# EAGLE design esp8266-DS18B20 (EAGLE 7.6.0)
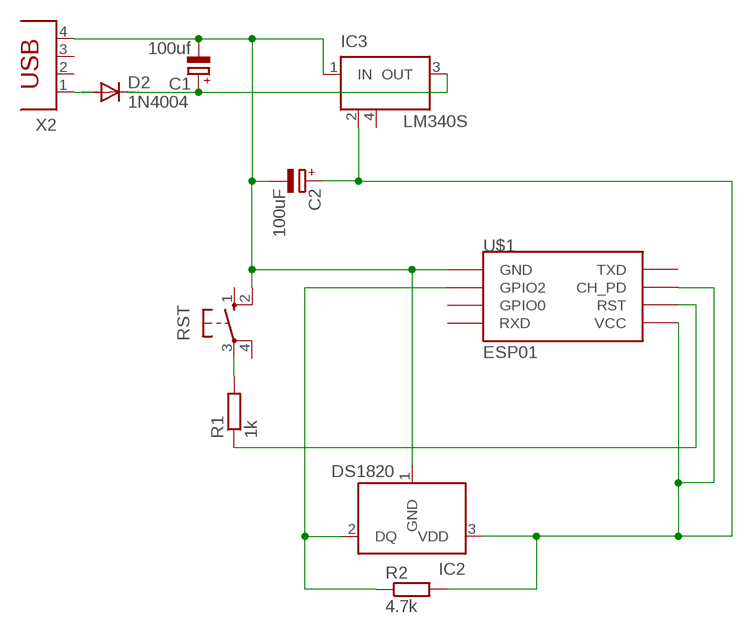
[diagram p0: schematic, sheet 1]

## Parts
C1  100uf  CPOL-EUE2.5-5  [E2,5-5]
C2  100uF  CPOL-EUE2.5-5  [E2,5-5]
D2  1N4004  [DO41-10]
IC2  DS1820  [TO-92]
IC3  LM340S  [SOT223]
R1  1k  R-EU_0207/12  [0207/12]
R2  4.7k  R-EU_0207/12  [0207/12]
RST  10-XX  [B3F-10XX]
U$1  ESP01  [ESP01]
X2  PN61729  [PN61729]

## Nets
3V3: C2.+ IC2.3(VDD) IC3.2(GND) R2.2 U$1.CH_PD U$1.VCC
5V: C1.+ D2.A D2.C IC3.3(OUT) X2.1
DQ: IC2.2(DQ) R2.1 U$1.GPIO2
GND: C1.- C2.- IC2.1(GND) IC3.1(IN) RST.2(S1) U$1.GND X2.4
GND(RST): R1.2 RST.3(P)
RST: R1.1 U$1.RST
Unconnected: RST.1(S) RST.4(P1) U$1.GPIO0 U$1.RX(RXD) U$1.TX(TXD) X2.2 X2.3

## Power pins joined to a net without a drawn wire
GND: IC3.4(GND)

## Library data of the parts
C1 C2 = rcl:CPOL-EU: POLARIZED CAPACITOR, European symbol
D2 = diode:1N4004: DIODE general purpose rectifier, 1 A
IC2 = DS1820:DS1820: DS1820 - 1-Wire Digital Thermometer
IC3 = linear:LM340S: 3-Terminal Positive Regulators Source: http://cache.national.com/ds/LM/LM340.pdf
R1 R2 = resistor:R-EU_: RESISTOR, European symbol
RST = switch-omron:10-XX: OMRON SWITCH; MPN: B3F-1000; OC_FARNELL: 176432; OC_NEWARK: 36M3542
U$1 = esp8266modules:ESP01: ESP8266 Wifi module 01
X2 = con-berg:PN61729: BERG USB connector; OC_FARNELL: unknown; OC_NEWARK: unknown

## Board
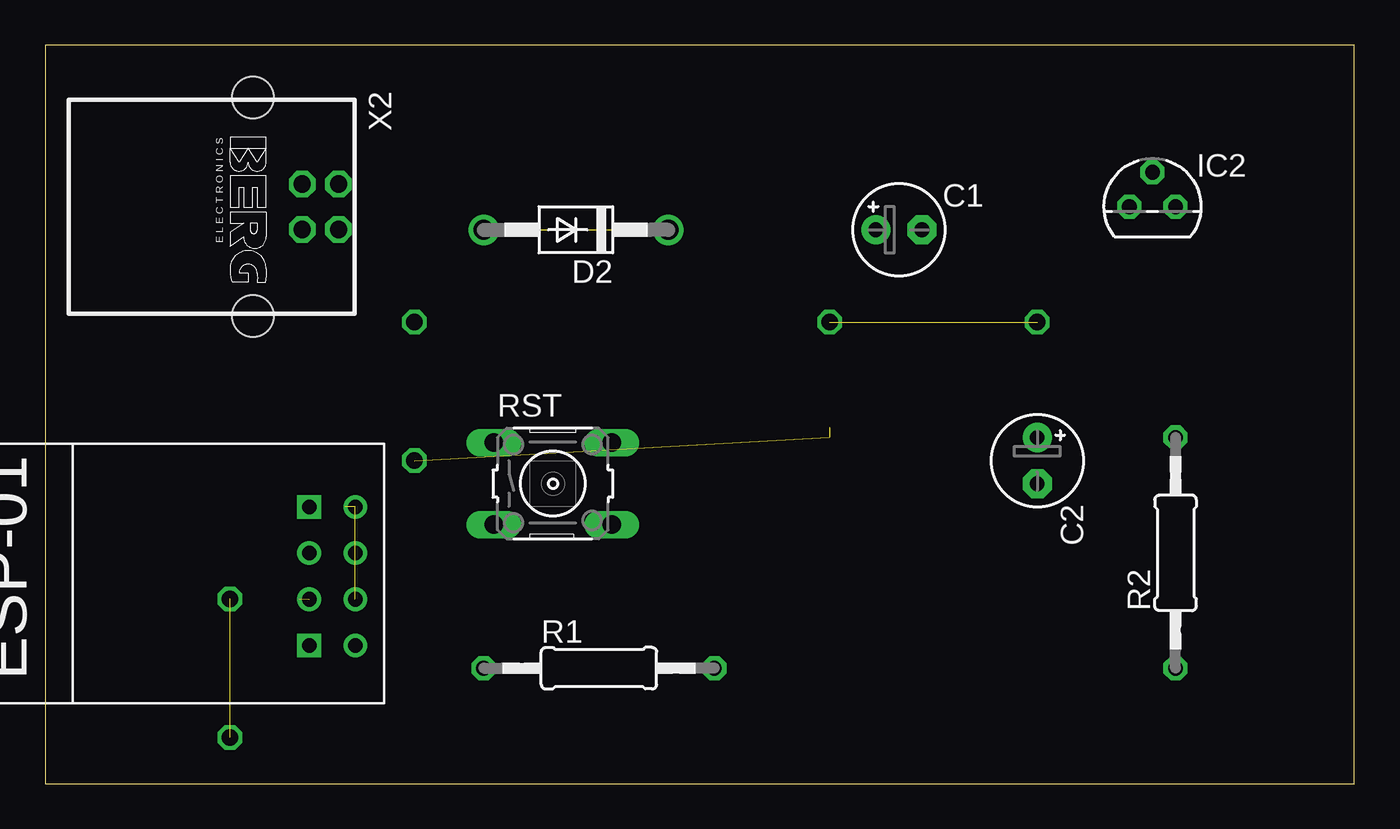
[diagram p1: board, top side]
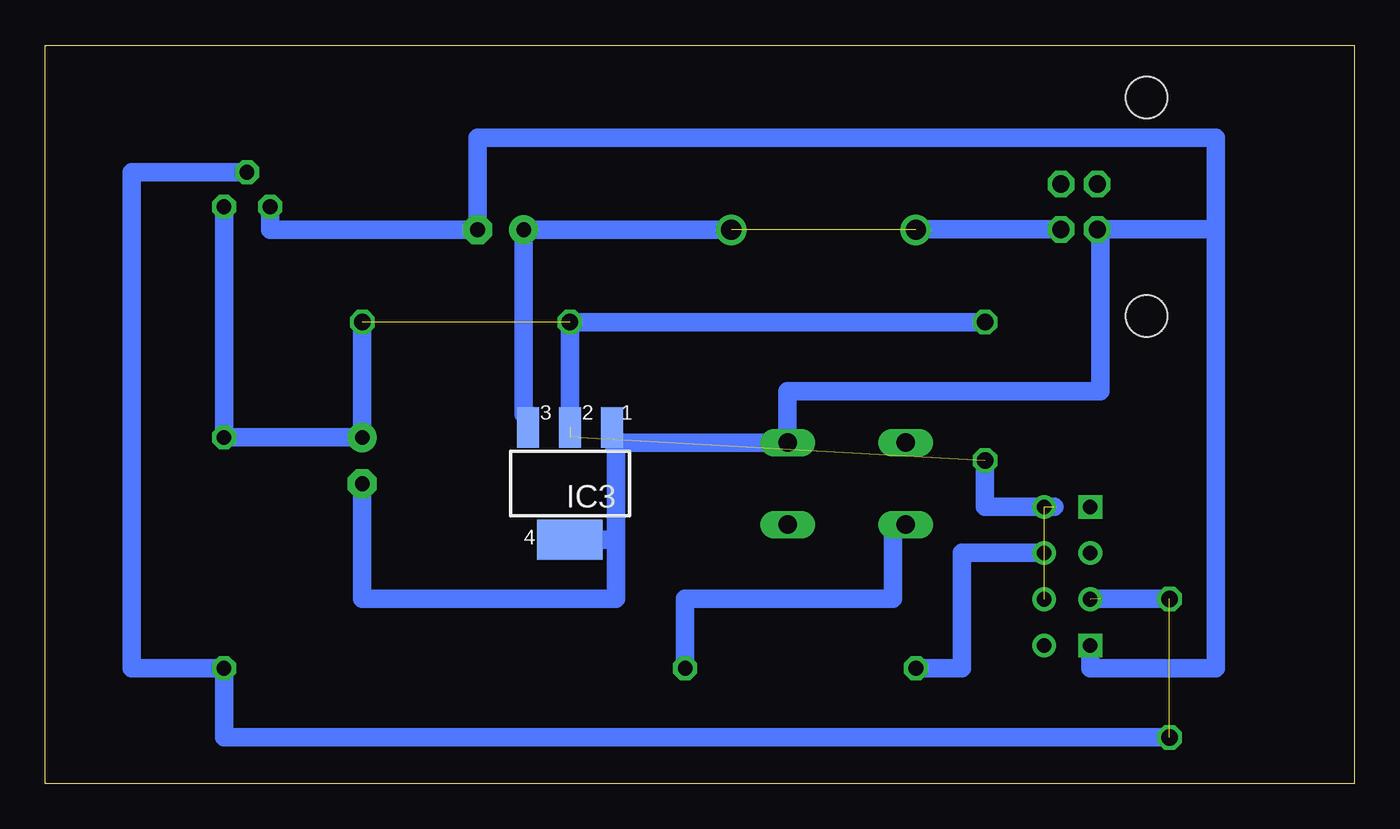
[diagram p2: board, bottom side, seen from below]

Size 72.06 x 40.63 mm. Coordinates in mm from the lower left corner, seen from the top.
Outline: 0,0 72.06,0 72.06,40.63 0,40.63 0,0
Copper layers (1*16): Top 0.035mm / dielectric 1.5mm / Bottom 0.035mm
Design rules "default": minimum track width 10mil, minimum drill 24mil, track to track 8mil, track to pad 8mil, pad to pad 8mil, via to via 8mil, smd to smd 8mil, copper to edge 40mil, drill to drill 8mil, minimum pad ring 10mil, minimum via ring 8mil, stop-mask expansion 4mil, vias tented up to drill 0mil, thermal gap 10mil

### Footprints (pad centres in the part's own frame; a part is rotated, then mirrored left to right if it is on the bottom)
E2,5-5 = drill 0.813 pad 1.6: + -1.27,0 | drill 0.813 pad 1.6 octagon: - 1.27,0
DO41-10 = drill 1.118: A 5.08,0; C -5.08,0
TO-92 = drill 0.813 pad 1.27 octagon: 1 -1.27,0; 2 0,1.905; 3 1.27,0
SOT223 = smd 1.219 x 2.235: 1 -2.311,-3.099; 2 0,-3.099; 3 2.311,-3.099 | smd 3.6 x 2.2: 4 0,3.099
0207/12 = drill 0.813 octagon: 1 -6.35,0; 2 6.35,0
B3F-10XX = drill 1.016 long: 1 -3.251,2.261; 2 3.251,2.261; 3 -3.251,-2.261; 4 3.251,-2.261
ESP01 = drill 0.8: CH_PD -1.285,-8.178; GPIO0 1.255,-5.638; GPIO2 -1.285,-5.638; RST 1.255,-8.178; TX -3.825,-8.178; VCC 3.795,-8.178 | drill 0.8 square: GND -3.825,-5.638; RX 3.795,-5.638
PN61729 = drill 0.95 octagon: 1 1.25,4.71; 2 -1.25,4.71; 3 -1.25,2.71; 4 1.25,2.71 | hole 2.3: -6.02,0; 6.02,0

### Placement (x,y rotation side)
C1  46.99,30.48 0 top
C2  54.61,17.78 270 top
D2  29.21,30.48 180 top
IC2  60.96,31.75 0 top
IC3  43.18,16.51 180 bottom
R1  30.48,6.35 0 top
R2  62.23,12.7 90 top
RST  27.94,16.51 0 top
U$1  8.89,11.43 90 top
X2  11.43,31.75 270 top

### Tracks (layer width: path | path; a pad name or v marks a point on that pad's centre or on a via)
3V3  (via drill 0.9)  (5 unrouted)
  Bottom 1.016: IC2.3 R2.2 C2.+ v54.61,25.4 | 43.18,19.05 v43.18,25.4 v20.32,25.4 | 16.51,15.24 20.32,15.24 v20.32,17.78
5V  (1 unrouted)
  Bottom 1.016: D2.C C1.+ 45.72,20.32 45.49,20.32 IC3.3 | X2.1 24.13,30.5 D2.A
DQ  (via drill 0.9)  (2 unrouted)
  Bottom 1.016: v10.16,10.16 13.97,10.16 | 10.16,2.54 62.23,2.54 R2.1 67.31,6.35 67.31,33.66 IC2.2
GND
  Bottom 1.016: 7.62,30.5 X2.4 13.97,30.5 13.97,21.59 31.19,21.59 RST.2 40.64,18.77 | 7.62,30.5 7.62,6.34 14.53,6.34 U$1.GND | IC3.1 40.87,18.77 40.64,18.77 | 7.62,30.5 7.62,35.56 48.26,35.56 C1.- 59.69,30.48 IC2.1 | 40.64,18.77 40.64,13.41 | 40.64,13.41 40.64,10.16 54.61,10.16 C2.- | IC3.4 40.64,13.41
GND(RST)
  Bottom 1.016: RST.3 25.4,14.25 25.4,10.16 36.83,10.16 R1.2
N$1  (via drill 0.9)
  other vias: 10.16,2.54
RST
  Bottom 1.016: R1.1 21.59,6.35 21.59,12.7 U$1.RST